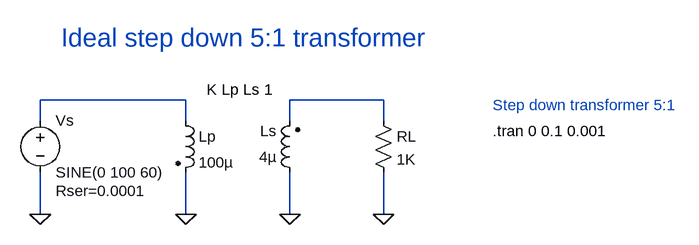
[diagram p0: schematic Transformer-step-down-5-1.asc]
Transformer-step-down-5-1.asc, the LTspice schematic file:
Version 4.1
SHEET 1 948 680
WIRE 160 32 -64 32
WIRE 464 32 320 32
WIRE -64 64 -64 32
WIRE 160 64 160 32
WIRE 320 64 320 32
WIRE 464 64 464 32
WIRE -64 208 -64 144
WIRE 160 208 160 144
WIRE 320 208 320 144
WIRE 464 208 464 144
FLAG -64 208 0
FLAG 160 208 0
FLAG 320 208 0
FLAG 464 208 0
SYMBOL ind2 144 48 R0
SYMATTR InstName Lp
SYMATTR Value 100µ
SYMATTR Type ind
SYMBOL ind2 336 160 R180
WINDOW 0 36 80 Left 2
WINDOW 3 36 40 Left 2
SYMATTR InstName Ls
SYMATTR Value 4µ
SYMATTR Type ind
SYMBOL voltage -64 48 R0
WINDOW 123 0 0 Left 2
WINDOW 39 24 124 Left 2
SYMATTR SpiceLine Rser=0.0001
SYMATTR InstName Vs
SYMATTR Value SINE(0 100 60)
SYMBOL res 448 48 R0
SYMATTR InstName RL
SYMATTR Value 1K
TEXT 192 16 Left 2 !K Lp Ls 1
TEXT 632 80 Left 2 !.tran 0 0.1 0.001
TEXT 632 40 Left 2 ;Step down transformer 5:1
TEXT -32 -64 Left 4 ;Ideal step down 5:1 transformer

The netlist it stands for:
* Transformer-step-down-5-1.asc
Lp N001 0 100µ
Ls 0 N002 4µ
Vs N001 0 SINE(0 100 60) Rser=0.0001
RL N002 0 1K
K Lp Ls 1
.tran 0 0.1 0.001
* Step down transformer 5:1
* Ideal step down 5:1 transformer
.backanno
.end